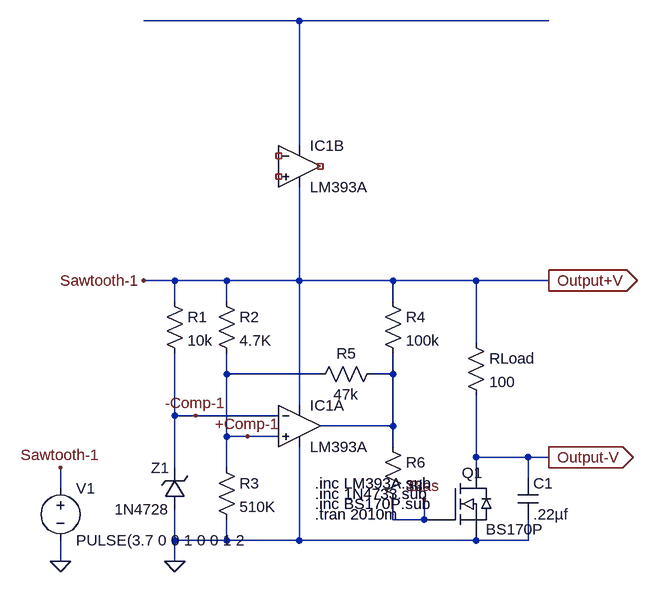
[diagram p0: schematic Li-IonBatteryProtection-LowCurrent.asc]
Li-IonBatteryProtection-LowCurrent.asc, the LTspice schematic file:
Version 4
SHEET 1 880 1044
WIRE 208 -448 -32 -448
WIRE 592 -448 208 -448
WIRE 208 -256 208 -448
WIRE 16 -48 -32 -48
WIRE 96 -48 16 -48
WIRE 208 -48 208 -192
WIRE 208 -48 96 -48
WIRE 352 -48 208 -48
WIRE 480 -48 352 -48
WIRE 592 -48 480 -48
WIRE 16 -16 16 -48
WIRE 96 -16 96 -48
WIRE 352 -16 352 -48
WIRE 480 48 480 -48
WIRE 96 96 96 64
WIRE 240 96 96 96
WIRE 352 96 352 64
WIRE 352 96 320 96
WIRE 208 144 208 -48
WIRE 16 160 16 64
WIRE 48 160 16 160
WIRE 176 160 48 160
WIRE 352 176 352 96
WIRE 352 176 240 176
WIRE 96 192 96 96
WIRE 128 192 96 192
WIRE 176 192 128 192
WIRE 352 208 352 176
WIRE 480 224 480 128
WIRE 560 224 480 224
WIRE 592 224 560 224
WIRE 16 240 16 160
WIRE 96 240 96 192
WIRE 480 240 480 224
WIRE 560 256 560 224
WIRE -160 272 -160 240
WIRE 352 320 352 288
WIRE 400 320 400 288
WIRE 400 320 352 320
WIRE 16 352 16 304
WIRE 96 352 96 320
WIRE 96 352 16 352
WIRE 208 352 208 208
WIRE 208 352 96 352
WIRE 480 352 208 352
WIRE 560 352 560 320
WIRE 560 352 480 352
WIRE -160 384 -160 352
WIRE 16 384 16 352
FLAG 16 384 0
FLAG -160 384 0
FLAG -160 240 Sawtooth-1
FLAG -32 -48 Sawtooth-1
FLAG 592 224 Output-V
IOPIN 592 224 Out
FLAG 592 -48 Output+V
IOPIN 592 -48 Out
FLAG 48 160 -Comp-1
FLAG 128 192 +Comp-1
FLAG 400 288 Bias
SYMBOL Opamps\\opamp2 208 112 R0
SYMATTR InstName IC1A
SYMATTR Value LM393A
SYMBOL res 0 -32 R0
SYMATTR InstName R1
SYMATTR Value 10k
SYMBOL res 80 -32 R0
SYMATTR InstName R2
SYMATTR Value 4.7K
SYMATTR SpiceLine tol=1 pwr=0.1
SYMBOL res 80 224 R0
SYMATTR InstName R3
SYMATTR Value 510K
SYMATTR SpiceLine tol=1 pwr=0.1
SYMBOL res 336 -32 R0
SYMATTR InstName R4
SYMATTR Value 100k
SYMATTR SpiceLine tol=1 pwr=0.1
SYMBOL zener 32 304 R180
WINDOW 0 24 64 Left 2
WINDOW 3 24 0 Left 2
SYMATTR InstName Z1
SYMATTR Value 1N4728
SYMBOL voltage -160 256 R0
WINDOW 123 0 0 Left 2
WINDOW 39 0 0 Left 2
SYMATTR InstName V1
SYMATTR Value PULSE(3.7 0 0 1 0 0 1 2
SYMBOL res 464 32 R0
SYMATTR InstName RLoad
SYMATTR Value 100
SYMBOL IRF540 416 304 R0
WINDOW 0 42 -56 Left 2
WINDOW 3 79 31 Left 2
SYMATTR InstName Q1
SYMATTR Value BS170P
SYMBOL res 336 80 R90
WINDOW 0 0 56 VBottom 2
WINDOW 3 32 56 VTop 2
SYMATTR InstName R5
SYMATTR Value 47k
SYMBOL res 336 192 R0
SYMATTR InstName R6
SYMATTR Value 33
SYMBOL cap 544 256 R0
SYMATTR InstName C1
SYMATTR Value .22µf
SYMBOL Opamps\\opamp2 208 -288 R0
SYMATTR InstName IC1B
SYMATTR Value LM393A
TEXT 232 264 Left 2 !.inc LM393A.sub
TEXT 232 280 Left 2 !.inc 1N4733.sub
TEXT 232 296 Left 2 !.inc BS170P.sub
TEXT 232 312 Left 2 !.tran 2010m

The netlist it stands for:
* Li-IonBatteryProtection-LowCurrent.asc
XIC1A +Comp-1 -Comp-1 Output+V 0 N002 LM393A  ; pins In+ In- V+ V- OUT
R1 Output+V -Comp-1 10k
R2 Output+V +Comp-1 4.7K tol=1 pwr=0.1
R3 +Comp-1 0 510K tol=1 pwr=0.1
R4 Output+V N002 100k tol=1 pwr=0.1
D§Z1 0 -Comp-1 1N4728
V1 Output+V 0 PULSE(3.7 0 0 1 0 0 1 2
RLoad Output+V Output-V 100
XQ1 Output-V Bias 0 BS170P  ; pins 1 2 3
R5 N002 +Comp-1 47k
R6 N002 Bias 33
C1 Output-V 0 .22µf
XIC1B NC_01 NC_02 N001 Output+V NC_03 LM393A  ; pins In+ In- V+ V- OUT
.model D D
.lib standard.dio
.inc LM393A.sub
.inc 1N4733.sub
.inc BS170P.sub
.tran 2010m
.backanno
.end